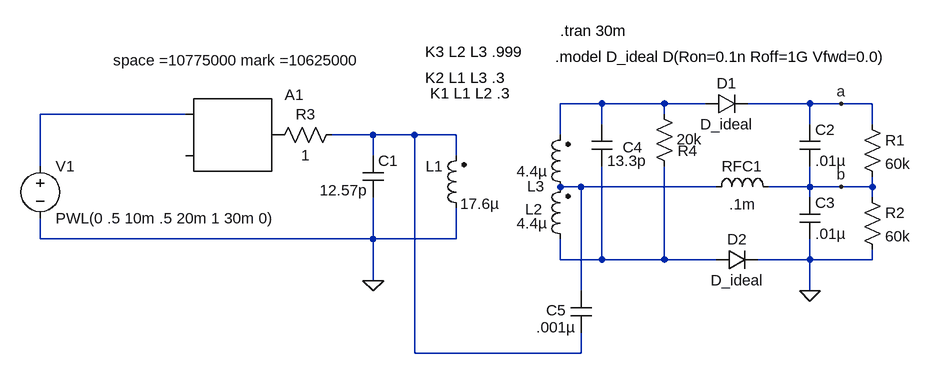
[diagram p0: schematic Draft3.asc]
Draft3.asc, the LTspice schematic file:
Version 4
SHEET 1 880 680
WIRE -240 -64 -304 -64
WIRE -144 -64 -240 -64
WIRE -80 -64 -144 -64
WIRE 80 -64 -16 -64
WIRE 128 -64 80 -64
WIRE 176 -64 128 -64
WIRE -880 -48 -1104 -48
WIRE -144 -48 -144 -64
WIRE -240 -32 -240 -64
WIRE 80 -32 80 -64
WIRE 176 -32 176 -64
WIRE -592 -16 -656 -16
WIRE -528 -16 -592 -16
WIRE -464 -16 -528 -16
WIRE -304 -16 -304 -64
WIRE -592 16 -592 -16
WIRE -464 16 -464 -16
WIRE -1104 32 -1104 -48
WIRE -272 64 -304 64
WIRE -64 64 -272 64
WIRE 80 64 80 32
WIRE 80 64 16 64
WIRE 128 64 80 64
WIRE 176 64 176 48
WIRE 176 64 128 64
WIRE 80 80 80 64
WIRE 176 80 176 64
WIRE -1104 144 -1104 112
WIRE -592 144 -592 80
WIRE -592 144 -1104 144
WIRE -464 144 -464 96
WIRE -464 144 -592 144
WIRE -304 176 -304 144
WIRE -240 176 -240 32
WIRE -240 176 -304 176
WIRE -144 176 -144 32
WIRE -144 176 -240 176
WIRE -64 176 -144 176
WIRE 80 176 80 144
WIRE 80 176 0 176
WIRE 176 176 176 160
WIRE 176 176 80 176
WIRE -592 208 -592 144
WIRE -272 224 -272 64
WIRE 80 224 80 176
WIRE -528 320 -528 -16
WIRE -272 320 -272 288
WIRE -272 320 -528 320
FLAG -592 208 0
FLAG 80 224 0
FLAG 128 -64 a
FLAG 128 64 b
SYMBOL ind2 -448 112 R180
WINDOW 0 36 80 Left 2
WINDOW 3 -51 22 Left 2
SYMATTR InstName L1
SYMATTR Value 17.6µ
SYMATTR Type ind
SYMBOL ind2 -288 80 R180
WINDOW 0 43 -18 Left 2
WINDOW 3 36 40 Left 2
SYMATTR InstName L2
SYMATTR Value 4.4µ
SYMATTR Type ind
SYMBOL cap -608 16 R0
WINDOW 3 -66 53 Left 2
SYMATTR Value 12.57p
SYMATTR InstName C1
SYMBOL res 160 -48 R0
SYMATTR InstName R1
SYMATTR Value 60k
SYMBOL cap 64 -32 R0
SYMATTR InstName C2
SYMATTR Value .01µ
SYMBOL diode -80 -48 R270
WINDOW 0 32 32 VTop 2
WINDOW 3 0 32 VBottom 2
SYMATTR InstName D1
SYMATTR Value D_ideal
SYMBOL diode -64 192 R270
WINDOW 0 32 32 VTop 2
WINDOW 3 0 32 VBottom 2
SYMATTR InstName D2
SYMATTR Value D_ideal
SYMBOL cap 64 80 R0
SYMATTR InstName C3
SYMATTR Value .01µ
SYMBOL cap -256 -32 R0
WINDOW 0 48 35 Left 2
SYMATTR InstName C4
SYMATTR Value 13.3p
SYMBOL res 160 64 R0
SYMATTR InstName R2
SYMATTR Value 60k
SYMBOL ind -80 80 R270
WINDOW 0 32 56 VTop 2
WINDOW 3 5 56 VBottom 2
SYMATTR InstName RFC1
SYMATTR Value .1m
SYMBOL res -640 -32 R90
WINDOW 0 0 56 VBottom 2
WINDOW 3 32 56 VTop 2
SYMATTR InstName R3
SYMATTR Value 1
SYMBOL cap -256 288 R180
WINDOW 0 39 34 Left 2
WINDOW 3 24 8 Left 2
SYMATTR InstName C5
SYMATTR Value .001µ
SYMBOL res -160 -64 R0
WINDOW 0 37 72 Left 2
WINDOW 3 35 55 Left 2
SYMATTR InstName R4
SYMATTR Value 20k
SYMBOL ind2 -288 160 R180
WINDOW 0 40 97 Left 2
WINDOW 3 36 40 Left 2
SYMATTR InstName L3
SYMATTR Value 4.4µ
SYMATTR Type ind
SYMBOL SpecialFunctions/modulate -880 -48 R0
WINDOW 3 -112 -83 Left 2
SYMATTR Value space =10775000 mark =10625000
SYMATTR InstName A1
SYMBOL voltage -1104 16 R0
WINDOW 123 0 0 Left 2
WINDOW 39 0 0 Left 2
SYMATTR InstName V1
SYMATTR Value PWL(0 .5 10m .5 20m 1 30m 0)
TEXT -312 -136 Left 2 !.model D_ideal D(Ron=0.1n Roff=1G Vfwd=0.0)
TEXT -512 -104 Left 2 !K2 L1 L3 .3
TEXT -512 -144 Left 2 !K3 L2 L3 .999
TEXT -504 -80 Left 2 !K1 L1 L2 .3
TEXT -304 -176 Left 2 !.tran 30m

The netlist it stands for:
* Draft3.asc
L1 0 N003 17.6µ
L2 N004 N001 4.4µ
C1 N003 0 12.57p
R1 a b 60k
C2 a b .01µ
D1 N001 a D_ideal
D2 N005 0 D_ideal
C3 b 0 .01µ
C4 N001 N005 13.3p
R2 b 0 60k
L§RFC1 N004 b .1m
R3 N003 P001 1
C5 N003 N004 .001µ
R4 N001 N005 20k
L3 N005 N004 4.4µ
A1 N002 0 0 0 0 0 P001 0 MODULATOR space =10775000 mark =10625000
V1 N002 0 PWL(0 .5 10m .5 20m 1 30m 0)
.model D D
.lib standard.dio
.model D_ideal D(Ron=0.1n Roff=1G Vfwd=0.0)
K2 L1 L3 .3
K3 L2 L3 .999
K1 L1 L2 .3
.tran 30m
.backanno
.end